# Altium project AnalogControlBoard.PrjPcb
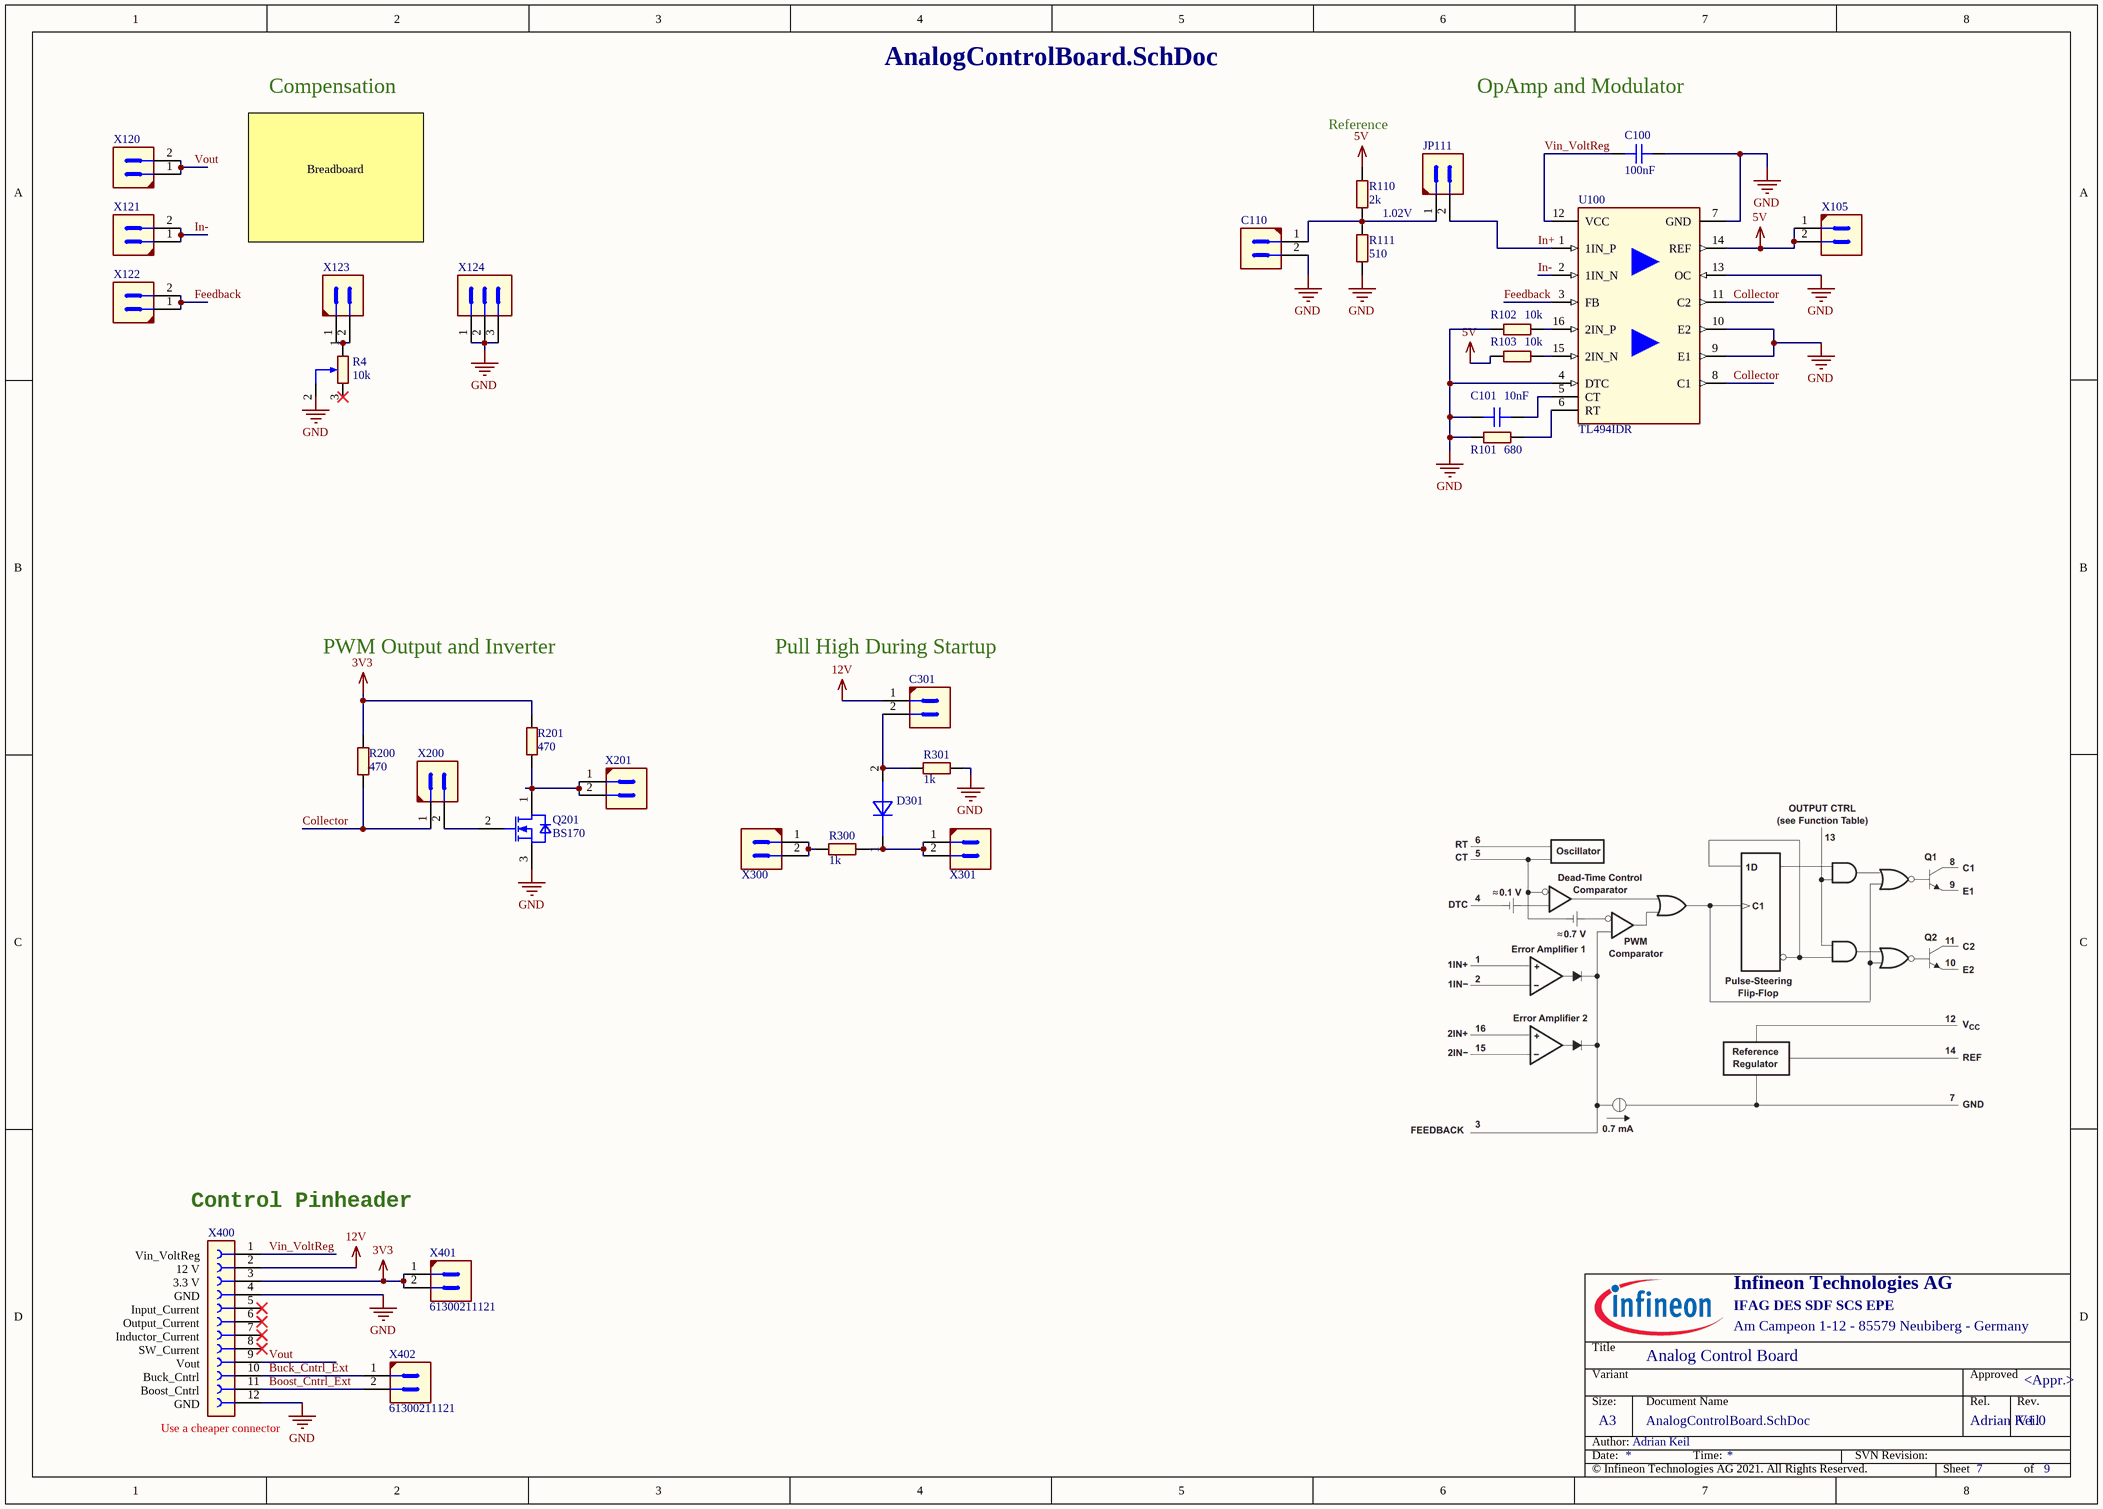
[diagram p0: AnalogControlBoard.SchDoc]
PRJ_Year: 07/2021; PRJ_Title: Analog Control Board; PRJ_SCH_Revision: V1.0; PRJ_SCH_Author: Adrian Keil; PRJ_Revision: V1.0; PRJ_Responsible: Adrian Keil; PRJ_PCB_Revision: V1.0; PRJ_PCB_Release: RC01; PRJ_PCBDesigner: Adrian Keil; PRJ_Organization: Infineon Technologies AG; PRJ_Engineer: Adrian Keil; PRJ_Copyright: © Infineon Technologies AG 2021. All Rights Reserved.; PRJ_Address2: Am Campeon 1-12 - 85579 Neubiberg - Germany; PRJ_Address1: IFAG DES SDF SCS EPE
1 sheet, 31 parts. Net scope: global (net labels, ports and power ports of the same name join across sheets).
Board file: AnalogControlBoard.PcbDoc

## Sheet AnalogControlBoard.SchDoc: <Project Name>
size A3; ApprovedBy: <Appr.>; Author: <Author>; CompanyName: Infineon Technologies AG; Engineer: <Rel.>; Organization: Infineon Technologies AG; Address1: IFAG DES S PS; Address2: Am Campeon 1-12  -  85579 Neubiberg  -  Germany; Address3: 85579 Neubiberg; Address4: Germany; DocumentNumber: 7; Revision: <Rev.>; SheetNumber: 7; SheetTotal: 9; Release: RC00; PageSetup: Record=PageOptions|CenterHorizontal=True|CenterVertical=True|PrintScale=1.01|XCorrection=1.00|YCorrection=1.00|PrintKind=0|BorderSize=5000000|LeftOffset=0|BottomOffset=0|Orientation=2|PaperLength=1000|PaperWidth=1000|Scale=100|PaperSource=7|PrintQuality=-4|MediaType=1|DitherType=10|PaperKind=A3|PrintScaleMode=1; Doc_ConfidentialStatus: <Doc_ConfidentialStatus>; Doc_Preliminary: <Doc_Preliminary>

### Parts
C100  100nF  [CAPRR254W51L508T318H736B]
C101  10nF  [CAPRR254W51L508T318H736B]
C110  61300211121  [CON-M-THT-61300211121]  (value not drawn)
C301  61300211121  [CON-M-THT-61300211121]  (value not drawn)
D301  1N4001-E3/54  [DIOAD1020W78L465D235B]  (value not drawn)
JP111  61300211121  [CON-M-THT-61300211121]  (value not drawn)
Q201  BS170  [TO92-THT-2Nxxxx]
R4  10k  [POT-SMD-3361P]
R101  680  [RESAD1060W54L680D250B]
R102  10k  [RESAD1060W54L680D250B]
R103  10k  [RESAD1060W54L680D250B]
R110  2k  [RESAD1060W54L680D250B]
R111  510  [RESAD1060W54L680D250B]
R200  470  [RESAD1060W54L680D250B]
R201  470  [RESAD1060W54L680D250B]
R300  1k  [RESAD1060W54L680D250B]
R301  1k  [RESAD1060W54L680D250B]
U100  TL494IDR  [SOIC127P600X175-16N-2-V]
X105  61300211121  [CON-M-THT-61300211121]  (value not drawn)
X120  61300211121  [CON-M-THT-61300211121]  (value not drawn)
X121  61300211121  [CON-M-THT-61300211121]  (value not drawn)
X122  61300211121  [CON-M-THT-61300211121]  (value not drawn)
X123  61300211121  [CON-M-THT-61300211121]  (value not drawn)
X124  61300311121  [CON-M-THT-61300311121]  (value not drawn)
X200  61300211121  [CON-M-THT-61300211121]  (value not drawn)
X201  61300211121  [CON-M-THT-61300211121]  (value not drawn)
X300  61300211121  [CON-M-THT-61300211121]  (value not drawn)
X301  61300211121  [CON-M-THT-61300211121]  (value not drawn)
X400  SSW-112-01-G-S  [CON-F-THT-SSW-112-01-G-S]  (value not drawn)
X401  61300211121  [CON-M-THT-61300211121]
X402  61300211121  [CON-M-THT-61300211121]

### Nets
3V3: R200.2 R201.2 X400.3 X401.1 X401.2
5V: R103.1 R110.2 U100.14(REF) X105.1 X105.2
12V: C301.1 X400.2
GND: C100.2 C101.1 C110.2 Q201.3(SOURCE) R4.2 R101.1 R102.1 R111.1 R301.1 U100.4(DTC) U100.7(GND) U100.9(E1) U100.10(E2) U100.13(OC) X124.1 X124.2 X124.3 X400.4 X400.12
Boost_Cntrl_Ext: X400.11 X402.2
Buck_Cntrl_Ext: X400.10 X402.1
Collector: R200.1 U100.8(C1) U100.11(C2) X200.1
Feedback: U100.3(FB) X122.1 X122.2
In+: JP111.2 U100.1(1IN_P)
In-: U100.2(1IN_N) X121.1 X121.2
Vin_VoltReg: C100.1 U100.12(VCC) X400.1
Vout: X120.1 X120.2 X400.9
NetC101_2: C101.2 U100.5(CT)
NetC110_1: C110.1 JP111.1 R110.1 R111.2
NetC301_2: C301.2 D301.2(Anode) R301.2
NetD301_1: D301.1(Cathode) R300.1 X301.1 X301.2
NetQ201_1: Q201.1(DRAIN) R201.1 X201.1 X201.2
NetQ201_2: Q201.2(GATE) X200.2
NetR4_1: R4.1 X123.1 X123.2
NetR101_2: R101.2 U100.6(RT)
NetR102_2: R102.2 U100.16(2IN_P)
NetR103_2: R103.2 U100.15(2IN_N)
NetR300_2: R300.2 X300.1 X300.2

Not connected (* = marked no-connect by the designer): R4 3*; X400 5* 6* 7* 8*

### Notes on the sheet
- Compensation
- OpAmp and Modulator
- Reference
- Breadboard
- 1.02V
- PWM Output and Inverter
- (near C301) Pull High During Startup
- (near X400) Control Pinheader
- (near X400) Vin_VoltReg
  12 V
  3.3 V
  GND
  Input_Current
  Output_Current
  Inductor_Current
  SW_Current
  Vout
  Buck_Cntrl
  Boost_Cntrl
  GND
- (near X400) Use a cheaper connector
- Title
- Variant
- Approved
- Date:
- Author:
- Size:
- A3
- Document Name
- Time:
- SVN Revision:
- Rel.
- Rev.
- Sheet
- of

### Library data of the parts
C100 C101 = 309824: CAP / CERA / 100nF / 50V / 10% / X7R (EIA) / -55°C to 125°C / 2.54mm C X 0.51mm W 5.08mm L X 3.18mm T X 7.36mm H / - / -; Multiple Parts: No; Legacy PartNumber: CAP01010813; Manufacturer: Kemet; Manufacturer Order Number: C320C104K5R5TA; Symbol Type: Capacitor; Single; Standard; 2 Pins; Alternate View: Yes; Article Number: 309824; Version Number: V01; Combined Parameters: TC:X7R (EIA);Tol.:-10%/+10%;Vdc:50V; QuickPick: 100nF / 50V / 10% / X7R (EIA) / Radial Type; Type: Standard; Style: Single; ComponentStatus: Released; PLMStatus: Active; Legacy DeviceID: CAP01010813; Part Type: Capacitor; Tolerance Neg: 10%; Tolerance Pos: 10%; Technology: Ceramic; Temperature min: -55; Temperature max: 125; Temperature Range: Military; ROHS Compliant: Y; Automotive Qualified: No; PackageReference: Radial Type; ComponentLink1Description: Vendor WebSite; ComponentLink1URL: http://www.kemet.com; ComponentLink2Description: Datasheet; ComponentLink2URL: http://webnetprod.muc.infineon.com/PCBPortal_Prod/WorkFlows/AltiumComponent/StandardDocumentation?Versionid=309825; Supplier 1: Farnell; Supplier Part Number 1: 1457655; Supplier 2: DigiKey; Supplier Part Number 2: 399-4264-ND; Supplier 3: Mouser; Supplier Part Number 3: 80-C320C104K5R; Second Source allowed: Yes; Voltage DC (max): 50V; Package Description: Capacitor,non-polarized,Radial,Rect. Body;2.54mm C X 0.51mm W 5.08mm L X 3.18mm T X 7.36mm H
  C100: Value: 100nF
  C101: Value: 10nF
C110 C301 = 386760: Header, 2.54mm Pitch, 2 pin, Vertical, Single Row; Legacy PartNumber: CON01500943; Manufacturer: Wurth Elektronik; Alternat View: Yes; Article Number: 386760; Version Number: V01; Legacy DeviceID: WE_61300211121; Combined Parameters: Board-to-Board Header (male);2x1;Mounting:THT;Orient:0° (vertical);Shielded:No; QuickPick: 0° (vertical) / Board-to-Board; Type: Board-to-Board; Style: Strip; Automotive Qualified: No; ComponentStatus: Released; PLMStatus: Active; Voltage DC (max): na; Part Type: Connector; Manufacturer Order Number: 61300211121; Value: 61300211121; Temperature min: -40; Temperature max: 105; Temperature Range: Industrial; ROHS Compliant: Y; ComponentLink1Description: Vendor WebSite; ComponentLink1URL: http://www.we-online.com; ComponentLink2Description: Datasheet; ComponentLink2URL: http://webnetprod.muc.infineon.com/PCBPortal_Prod/WorkFlows/AltiumComponent/StandardDocumentation?Versionid=386761; Supplier 1: Farnell; Supplier Part Number 1: 2356153; Supplier 2: DigiKey; Supplier Part Number 2: 732-5315-ND; Supplier 3: Mouser; Supplier Part Number 3: 710-61300211121; Second Source allowed: Yes; Package Description: Header, Vertical, 2.54mm Pitch; 2 Pins, Single row, 5.08mm L X 2.54mm W X 8.89mm H body
D301 = 395830: General Purpose Plastic Rectifier, 1.0A/50Vrrm; Legacy PartNumber: DIO01300395; Manufacturer: Vishay; Symbol Type: Standard Diode Symbol, 2 Leads, 1 Cathode, 2 Anode; Article Number: 395830; Version Number: V01; Combined Parameters: Vf:1.1V;If:1A;Ur:50V;Ir:5uA;Pmax:-; QuickPick: Standard Diode / DO-204AL (DO-41); Type: Standard Diode; Style: Single; Automotive Qualified: No; ComponentStatus: Released; PLMStatus: Active; Second Source allowed: Yes; Voltage DC (max): na; Legacy DeviceID: DIO01300395; Part Type: Diode; Manufacturer Order Number: 1N4001-E3/54; Value: 1N4001-E3/54; Application: Standard; Temperature min: -50; Temperature max: 150; Temperature Range: Automotive; ROHS Compliant: Y; PackageReference: DO-204AL (DO-41); ComponentLink1Description: Vendor WebSite; ComponentLink1URL: http://www.vishay.com; ComponentLink2Description: Datasheet; ComponentLink2URL: http://webnetprod.muc.infineon.com/PCBPortal_Prod/WorkFlows/AltiumComponent/StandardDocumentation?Versionid=395831; Supplier 1: Farnell; Supplier Part Number 1: 1836777; Supplier 2: DigiKey; Supplier Part Number 2: 1N4001-E3/54GITR-ND; Supplier 3: Mouser; Supplier Part Number 3: 625-1N4001-E3/54; Package Description: Diode,Axial;10.20mm C X 0.785mm W 4.65mm L X 2.35mm Dia
JP111 X105 X120-X123 X200 X201 X300 X301 X401 X402 = 386760: Header, 2.54mm Pitch, 2 pin, Vertical, Single Row; Legacy PartNumber: CON01500943; Manufacturer: Wurth Elektronik; Alternat View: Yes; Article Number: 386760; Version Number: V01; Legacy DeviceID: WE_61300211121; Combined Parameters: Board-to-Board Header (male);2x1;Mounting:THT;Orient:0° (vertical);Shielded:No; QuickPick: 0° (vertical) / Board-to-Board; Style: Strip; Automotive Qualified: No; ComponentStatus: Released; PLMStatus: Active; Voltage DC (max): na; Part Type: Connector; Manufacturer Order Number: 61300211121; Value: 61300211121; Type: Board-to-Board; Temperature min: -40; Temperature max: 105; Temperature Range: Industrial; ROHS Compliant: Y; ComponentLink1Description: Vendor WebSite; ComponentLink1URL: http://www.we-online.com; ComponentLink2Description: Datasheet; ComponentLink2URL: http://webnetprod.muc.infineon.com/PCBPortal_Prod/WorkFlows/AltiumComponent/StandardDocumentation?Versionid=386761; Supplier 1: Farnell; Supplier Part Number 1: 2356153; Supplier 2: DigiKey; Supplier Part Number 2: 732-5315-ND; Supplier 3: Mouser; Supplier Part Number 3: 710-61300211121; Second Source allowed: Yes; Package Description: Header, Vertical, 2.54mm Pitch; 2 Pins, Single row, 5.08mm L X 2.54mm W X 8.89mm H body
Q201 = 439845: N-Channel, Small Signal MOSFET, 500 mA, 60 Volts; Legacy PartNumber: TRA00100106; Manufacturer: ON Semiconductor; Symbol Type: Insulated-Gate Field-Effect Transistor (IGFET), N-Channel, Enhancement, Body Diode, Pin 1 Drain, 2 Gate, 3 Source, 3 Pins; Article Number: 439845; Version Number: V01; Legacy DeviceID: ONSEMI_BS170; Combined Parameters: N-Channel Enhancement;Uds:60V;Id:500mA;Rds:1.8R;P:350mW; QuickPick: N-Channel Enhancement / 350mW / 500mA / 60V / TO-92 (TO-226); Type: N-Channel Enhancement; Style: Single; Automotive Qualified: No; ComponentStatus: Released; PLMStatus: Active; Second Source allowed: Yes; Voltage DC (max): na; Part Type: Transistor FET; Manufacturer Order Number: BS170; Value: BS170; Application: Small Signal; Temperature min: -55; Temperature max: 150; Temperature Range: Military; ROHS Compliant: N; PackageReference: TO-92 (TO-226); ComponentLink1Description: Vendor WebSite; ComponentLink1URL: http://onsemi.com/; ComponentLink2Description: Datasheet; ComponentLink2URL: http://webnetprod.muc.infineon.com/PCBPortal_Prod/WorkFlows/AltiumComponent/StandardDocumentation?Versionid=439846; Supplier 1: Farnell; Supplier Part Number 1: 1017687; Supplier 2: DigiKey; Supplier Part Number 2: BS170-ND; Supplier 3: Mouser; Supplier Part Number 3: 512-BS170; Package Description: TO-92,2.6mm pitch;3 pin,4.825mm L X 3.685mm W X 9.33mm H body
R4 = 630020: RES / VAR / 10k / 500mW / 10% / 100ppm/K / -55°C to 125°C /  3 pin, 7.04 mm L X 6.71 mm W X 5.84 mm H Body / SMD / -; Multiple Parts: No; Manufacturer: Bourns; Manufacturer Order Number: 3361P-1-103GLF; Alternate View: Yes; Symbol Type: Resistor; Single; Variable; 3 Pins; Article Number: 630020; Version Number: V01; Combined Parameters: TCR:100ppm/K;Tol.:-10%/+10%;Vdc:-;Idc:-;P:500mW; QuickPick: 10k / 10% / 0.5 / SMD; Style: Single; ComponentStatus: Released; PLMStatus: Active; Part Type: Resistor; Value: 10k; Tolerance Neg: 10%; Tolerance Pos: 10%; Type: Variable; Application: Standard; Temperature min: -55; Temperature max: 125; Temperature Range: Military; ROHS Compliant: Y; Automotive Qualified: No; PackageReference: SMD; ComponentLink1Description: Vendor WebSite; ComponentLink1URL: http://www.bourns.com; ComponentLink2Description: Datasheet; ComponentLink2URL: http://webnetprod.muc.infineon.com/PCBPortal_Prod/WorkFlows/AltiumComponent/StandardDocumentation?Versionid=630021; Supplier 1: Farnell; Supplier Part Number 1: 1696060; Supplier 2: DigiKey; Supplier Part Number 2: 3361P-103GLFCT-ND; Supplier 3: Mouser; Supplier Part Number 3: 652-3361P-1-103GLF; Second Source allowed: Yes; Package Description: Potentiometer, SMD; 3 pin, 7.04 mm L X 6.71 mm W X 5.84 mm H Body
R101-R103 R110 R111 R200 R201 R300 R301 = 653345: RES / STD / 10k / 250mW / 1% / 50ppm/K / - / 10.60mm C X 0.54mm W 6.80mm L X 2.50mm Dia / - / -; Multiple Parts: No; Manufacturer: Multicomp; Manufacturer Order Number: MF25 10K; Symbol Type: Resistor; Single; Standard; 2 Pins; Alternate View: Yes; Article Number: 653345; Version Number: V00; Combined Parameters: TCR:50ppm/K;Tol.:-1%/+1%;Vdc:250V;Idc:-;P:250mW; QuickPick: 10k / 1% / 0.25 / Through Hole; Style: Single; ComponentStatus: Released; PLMStatus: Active; Voltage DC (max): 250V; Part Type: Resistor; Tolerance Neg: 1%; Tolerance Pos: 1%; Type: Standard; Application: Standard; Technology: Metal Film; Temperature min: 0; Temperature max: 0; Temperature Range: Military; ROHS Compliant: N; Automotive Qualified: No; PackageReference: Through Hole; ComponentLink1Description: Vendor WebSite; ComponentLink1URL: http://www.farnellinone.com; ComponentLink2Description: Datasheet; ComponentLink2URL: http://webnetprod.muc.infineon.com/PCBPortal_Prod/WorkFlows/AltiumComponent/StandardDocumentation?Versionid=653346; Supplier 1: Farnell; Supplier Part Number 1: 9341110; Supplier 2: DigiKey; Supplier 3: Mouser; Second Source allowed: Yes; Package Description: Resistor,Axial;10.60mm C X 0.54mm W 6.80mm L X 2.50mm Dia
  R101: Value: 680
  R102 R103: Value: 10k
  R110: Value: 2k
  R111: Value: 510
  R200 R201: Value: 470
  R300 R301: Value: 1k
U100 = 646800: Manufacturer: Texas Instruments; Symbol Type: Pulse-Width-Modulation Control Circuit; Alternate View: No; Article Number: 646800; Version Number: V01; Legacy DeviceID: TI_TL494IDR; Combined Parameters: Switched Not applicable -;Vo:4.75V to 5.25V; QuickPick: Switched / SOIC-16 (D); Style: Not applicable; ComponentStatus: Released; PLMStatus: Active; Second Source allowed: Yes; Voltage DC (max): na; Multiple Parts: No; Part Type: Power Supply; Manufacturer Order Number: TL494IDR; Value: TL494IDR; Type: Switched; Temperature min: -40; Temperature max: 85; Temperature Range: Industrial; ROHS Compliant: Y; Automotive Qualified: No; PackageReference: SOIC-16 (D); ComponentLink1Description: Vendor WebSite; ComponentLink1URL: http://www.ti.com; ComponentLink2Description: Datasheet; ComponentLink2URL: http://webnetprod.muc.infineon.com/PCBPortal_Prod/WorkFlows/AltiumComponent/StandardDocumentation?Versionid=646801; Supplier 1: Farnell; Supplier Part Number 1: 3008539; Supplier 2: DigiKey; Supplier Part Number 2: 296-24387-1-ND; Supplier 3: Mouser; Supplier Part Number 3: 595-TL494IDR; Package Description: SOIC,1.27mm pitch;16 pin,3.90mm W X 9.90mm L X 1.75mm H body
X124 = 633993: WR-PHD Pin Header; Manufacturer: Wurth Elektronik; Article Number: 633993; Version Number: V01; Legacy DeviceID: WE_61300311121; Combined Parameters: Board-to-Cable Header (male);3x1;Mounting:THT;Orient:0° (vertical);Shielded:No; QuickPick: 0° (vertical) / Board-to-Cable; Style: Strip; Automotive Qualified: No; ComponentStatus: Released; PLMStatus: Active; Second Source allowed: Yes; Voltage DC (max): na; Part Type: Connector; Manufacturer Order Number: 61300311121; Value: 61300311121; Type: Board-to-Cable; Temperature min: -40; Temperature max: 105; Temperature Range: Industrial; ROHS Compliant: Y; PackageReference: THT; ComponentLink1Description: Vendor WebSite; ComponentLink1URL: http://www.we-online.com; ComponentLink2Description: Datasheet; ComponentLink2URL: http://webnetprod.muc.infineon.com/PCBPortal_Prod/WorkFlows/AltiumComponent/StandardDocumentation?Versionid=633994; Supplier 1: Farnell; Supplier Part Number 1: 2356154; Supplier 2: DigiKey; Supplier Part Number 2: 732-5316-ND; Supplier 3: Mouser; Supplier Part Number 3: 710-61300311121; Package Description: Connector, THT; 2.54mm pitch, 7.62 mm L X 2.54 mm X 8.89 mm H body
X400 = 653681: Through Hole, .025 SQ Post Socket, Up to 8 Gbps performance, 4.7A current rating, 12Pins, 2.54mm Pitch, Vertical; Manufacturer: Samtec; Symbol Type: Socket 12 Pins; Article Number: 653681; Version Number: V00; Legacy DeviceID: SAM_SSW-112-01-G-S; Combined Parameters: Board-to-Board Socket (female);12x1;Mounting:THT;Orient:0° (vertical);Shielded:No; QuickPick: 0° (vertical) / Board-to-Board; Style: Strip; Automotive Qualified: No; ComponentStatus: Released; PLMStatus: Active; Second Source allowed: Yes; Voltage DC (max): na; Part Type: Connector; Manufacturer Order Number: SSW-112-01-G-S; Value: SSW-112-01-G-S; Type: Board-to-Board; Temperature min: -55; Temperature max: 125; Temperature Range: Military; ROHS Compliant: Y; PackageReference: THT; ComponentLink1Description: Vendor WebSite; ComponentLink1URL: http://www.samtec.com/; ComponentLink2Description: Datasheet; ComponentLink2URL: http://webnetprod.muc.infineon.com/PCBPortal_Prod/WorkFlows/AltiumComponent/StandardDocumentation?Versionid=653682; Supplier 1: Farnell; Supplier Part Number 1: 1668381; Supplier 2: DigiKey; Supplier Part Number 2: SAM1209-12-ND; Supplier 3: Mouser; Supplier Part Number 3: 200-SSW11201GS; Package Description: Socket, THT; 2.54mm pitch, 12 pin, 30.99mm L X 2.41 mm W X 8.64 mm H body

## Assembly variants
Default_Assembly: all parts fitted